# Altium schematic sheet shift_registers.SchDoc
size A4; SheetNumber: 4; SheetTotal: 5
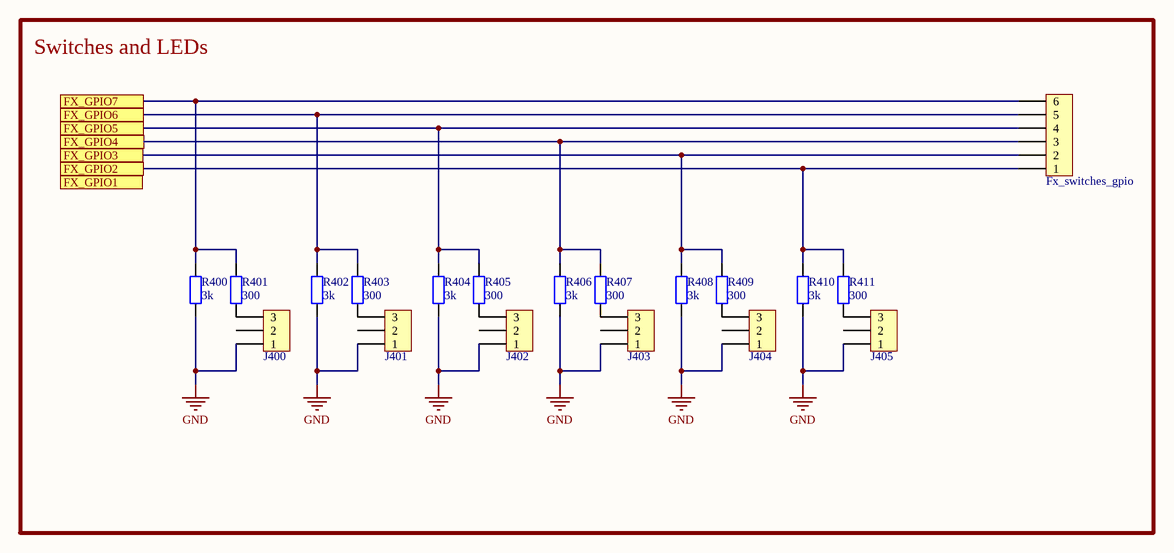
[diagram p0: shift_registers.SchDoc]

## Parts
Fx_switches_gpio  Header 1x6  [Header 1x6]  (value not drawn)
J400  Header 1x3  [Header 1x3]  (value not drawn)
J401  Header 1x3  [Header 1x3]  (value not drawn)
J402  Header 1x3  [Header 1x3]  (value not drawn)
J403  Header 1x3  [Header 1x3]  (value not drawn)
J404  Header 1x3  [Header 1x3]  (value not drawn)
J405  Header 1x3  [Header 1x3]  (value not drawn)
R400  value 3k  [AXIAL-0.4 PCBK]
R401  value 300  [AXIAL-0.4 PCBK]
R402  value 3k  [AXIAL-0.4 PCBK]
R403  value 300  [AXIAL-0.4 PCBK]
R404  value 3k  [AXIAL-0.4 PCBK]
R405  value 300  [AXIAL-0.4 PCBK]
R406  value 3k  [AXIAL-0.4 PCBK]
R407  value 300  [AXIAL-0.4 PCBK]
R408  value 3k  [AXIAL-0.4 PCBK]
R409  value 300  [AXIAL-0.4 PCBK]
R410  value 3k  [AXIAL-0.4 PCBK]
R411  value 300  [AXIAL-0.4 PCBK]

## Blocks framed on the sheet
Switches and LEDs: Fx_switches_gpio J400-J405 R400-R411

## Ports
FX_GPIO1, FX_GPIO2, FX_GPIO3, FX_GPIO4, FX_GPIO5, FX_GPIO6, FX_GPIO7

## Nets
GND: J400.1 J401.1 J402.1 J403.1 J404.1 J405.1 R400.1 R402.1 R404.1 R406.1 R408.1 R410.1
FX_GPIO2: Fx_switches_gpio.1 R410.2 R411.2 ; port FX_GPIO2
FX_GPIO3: Fx_switches_gpio.2 R408.2 R409.2 ; port FX_GPIO3
FX_GPIO4: Fx_switches_gpio.3 R406.2 R407.2 ; port FX_GPIO4
FX_GPIO5: Fx_switches_gpio.4 R404.2 R405.2 ; port FX_GPIO5
FX_GPIO6: Fx_switches_gpio.5 R402.2 R403.2 ; port FX_GPIO6
FX_GPIO7: Fx_switches_gpio.6 R400.2 R401.2 ; port FX_GPIO7
NetJ400_3: J400.3 R401.1
NetJ401_3: J401.3 R403.1
NetJ402_3: J402.3 R405.1
NetJ403_3: J403.3 R407.1
NetJ404_3: J404.3 R409.1
NetJ405_3: J405.3 R411.1

Not connected (* = marked no-connect by the designer): J400 2; J401 2; J402 2; J403 2; J404 2; J405 2

## Library data of the parts
R400-R411 = Res PCBK: Resistor; Published: 8-Jun-2000; LatestRevisionDate: 17-Jul-2002; LatestRevisionNote: Re-released for DXP Platform.; PackageReference: AXIAL-0.4; Publisher: Altium Limited